# Altium schematic sheet CH340G9T-R0.SchDoc
size 165 x 165 mm; SheetNumber: 0; SheetTotal: 0
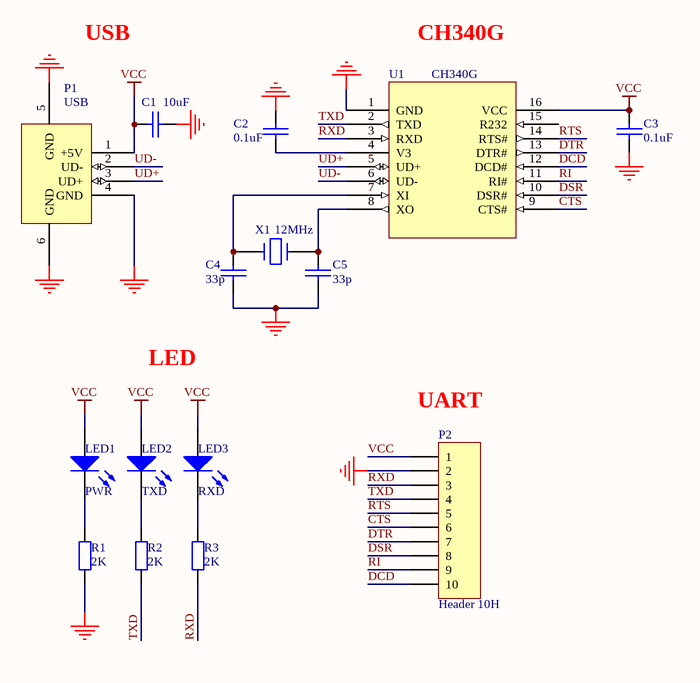
[diagram p0: CH340G9T-R0.SchDoc]

## Parts
C1  10uF  [3216_C]
C2  0.1uF  [0603_C]
C3  0.1uF  [0603_C]
C4  33p  [0603_C]
C5  33p  [0603_C]
LED1  PWR  [0603+]
LED2  TXD  [0603+]
LED3  RXD  [0603+]
P1  USB  [USBAM]
P2  Header 10H  [SIP10-2.54mm]
R1  2K  [0603]
R2  2K  [0603]
R3  2K  [0603]
U1  CH340G  [SOP16]
X1  12MHz  [XT3225]

## Nets
GND: C1.2 C2.2 C3.2 C4.2 C5.2 P1.4(GND) P1.5(GND) P1.6(GND) P2.2 R1.2 U1.1(GND)
VCC: C1.1 C3.1 LED1.1(A) LED2.1(A) LED3.1(A) P1.1(+5V) P2.1 U1.16(VCC)
CTS: P2.6 U1.9(CTS#)
DCD: P2.10 U1.12(DCD#)
DSR: P2.8 U1.10(DSR#)
DTR: P2.7 U1.13(DTR#)
RI: P2.9 U1.11(RI#)
RTS: P2.5 U1.14(RTS#)
RXD: P2.3 R3.2 U1.3(RXD)
TXD: P2.4 R2.2 U1.2(TXD)
UD+: P1.3(UD+) U1.5(UD+)
UD-: P1.2(UD-) U1.6(UD-)
NetC2_1: C2.1 U1.4(V3)
NetC4_1: C4.1 U1.7(XI) X1.1
NetC5_1: C5.1 U1.8(XO) X1.3
NetLED1_2: LED1.2(K) R1.1
NetLED2_2: LED2.2(K) R2.1
NetLED3_2: LED3.2(K) R3.1

Not connected (* = marked no-connect by the designer): U1 15(R232)

## Notes on the sheet
- USB
- CH340G
- LED
- (near P2) UART

## Library data of the parts
C1-C5 = CAP: Capacitor
LED1-LED3 = LED2: Typical RED, GREEN, YELLOW, AMBER GaAs LED
P2 = Header 10H: Header, 10-Pin, Right Angle; LatestRevisionDate: 17-Jul-2002; LatestRevisionNote: Re-released for DXP Platform.; Publisher: Altium Limited
R1-R3 = Res2: Resistor
U1 = CH340G: USB to TTL Serial / UART
X1 = CRYSTAL